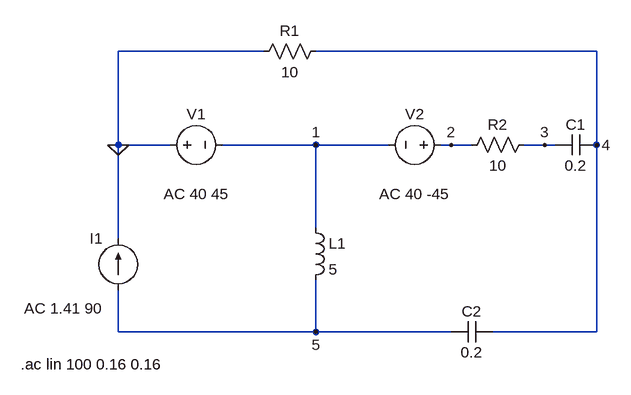
[diagram p0: schematic AC.asc]
AC.asc, the LTspice schematic file:
Version 4
SHEET 1 880 680
WIRE 0 -64 -224 -64
WIRE 512 -64 80 -64
WIRE -224 80 -224 -64
WIRE -144 80 -224 80
WIRE 80 80 -64 80
WIRE 192 80 80 80
WIRE 288 80 272 80
WIRE 320 80 288 80
WIRE 432 80 400 80
WIRE 448 80 432 80
WIRE 512 80 512 -64
WIRE 80 208 80 80
WIRE -224 224 -224 80
WIRE -224 368 -224 304
WIRE 80 368 80 288
WIRE 80 368 -224 368
WIRE 288 368 80 368
WIRE 512 368 512 80
WIRE 512 368 352 368
FLAG -224 80 0
FLAG 80 80 1
FLAG 288 80 2
FLAG 432 80 3
FLAG 512 80 4
FLAG 80 368 5
SYMBOL res 96 -80 R90
WINDOW 0 0 56 VBottom 2
WINDOW 3 32 56 VTop 2
SYMATTR InstName R1
SYMATTR Value 10
SYMBOL voltage -160 80 R270
WINDOW 0 32 56 VTop 2
WINDOW 3 -32 56 VBottom 2
WINDOW 123 -60 56 VBottom 2
WINDOW 39 0 0 Left 0
SYMATTR InstName V1
SYMATTR Value ""
SYMATTR Value2 AC 40 45
SYMBOL voltage 288 80 R90
WINDOW 0 -32 56 VBottom 2
WINDOW 3 32 56 VTop 2
WINDOW 123 60 56 VTop 2
WINDOW 39 0 0 Left 0
SYMATTR InstName V2
SYMATTR Value ""
SYMATTR Value2 AC 40 -45
SYMBOL res 416 64 R90
WINDOW 0 0 56 VBottom 2
WINDOW 3 32 56 VTop 2
SYMATTR InstName R2
SYMATTR Value 10
SYMBOL cap 512 64 R90
WINDOW 0 0 32 VBottom 2
WINDOW 3 32 32 VTop 2
SYMATTR InstName C1
SYMATTR Value 0.2
SYMBOL ind 64 192 R0
SYMATTR InstName L1
SYMATTR Value 5
SYMBOL cap 352 352 R90
WINDOW 0 0 32 VBottom 2
WINDOW 3 32 32 VTop 2
SYMATTR InstName C2
SYMATTR Value 0.2
SYMBOL current -224 304 R180
WINDOW 0 24 80 Left 2
WINDOW 3 24 0 Left 2
WINDOW 123 24 -28 Left 2
WINDOW 39 0 0 Left 0
SYMATTR InstName I1
SYMATTR Value ""
SYMATTR Value2 AC 1.41 90
TEXT -374 418 Left 2 !.ac lin 100 0.16 0.16

The netlist it stands for:
* AC.asc
R1 4 0 10
V1 0 1 AC 40 45
V2 2 1 AC 40 -45
R2 3 2 10
C1 4 3 0.2
L1 1 5 5
C2 4 5 0.2
I1 5 0 AC 1.41 90
.ac lin 100 0.16 0.16
.backanno
.end